# Altium project FOC module.PrjPcb
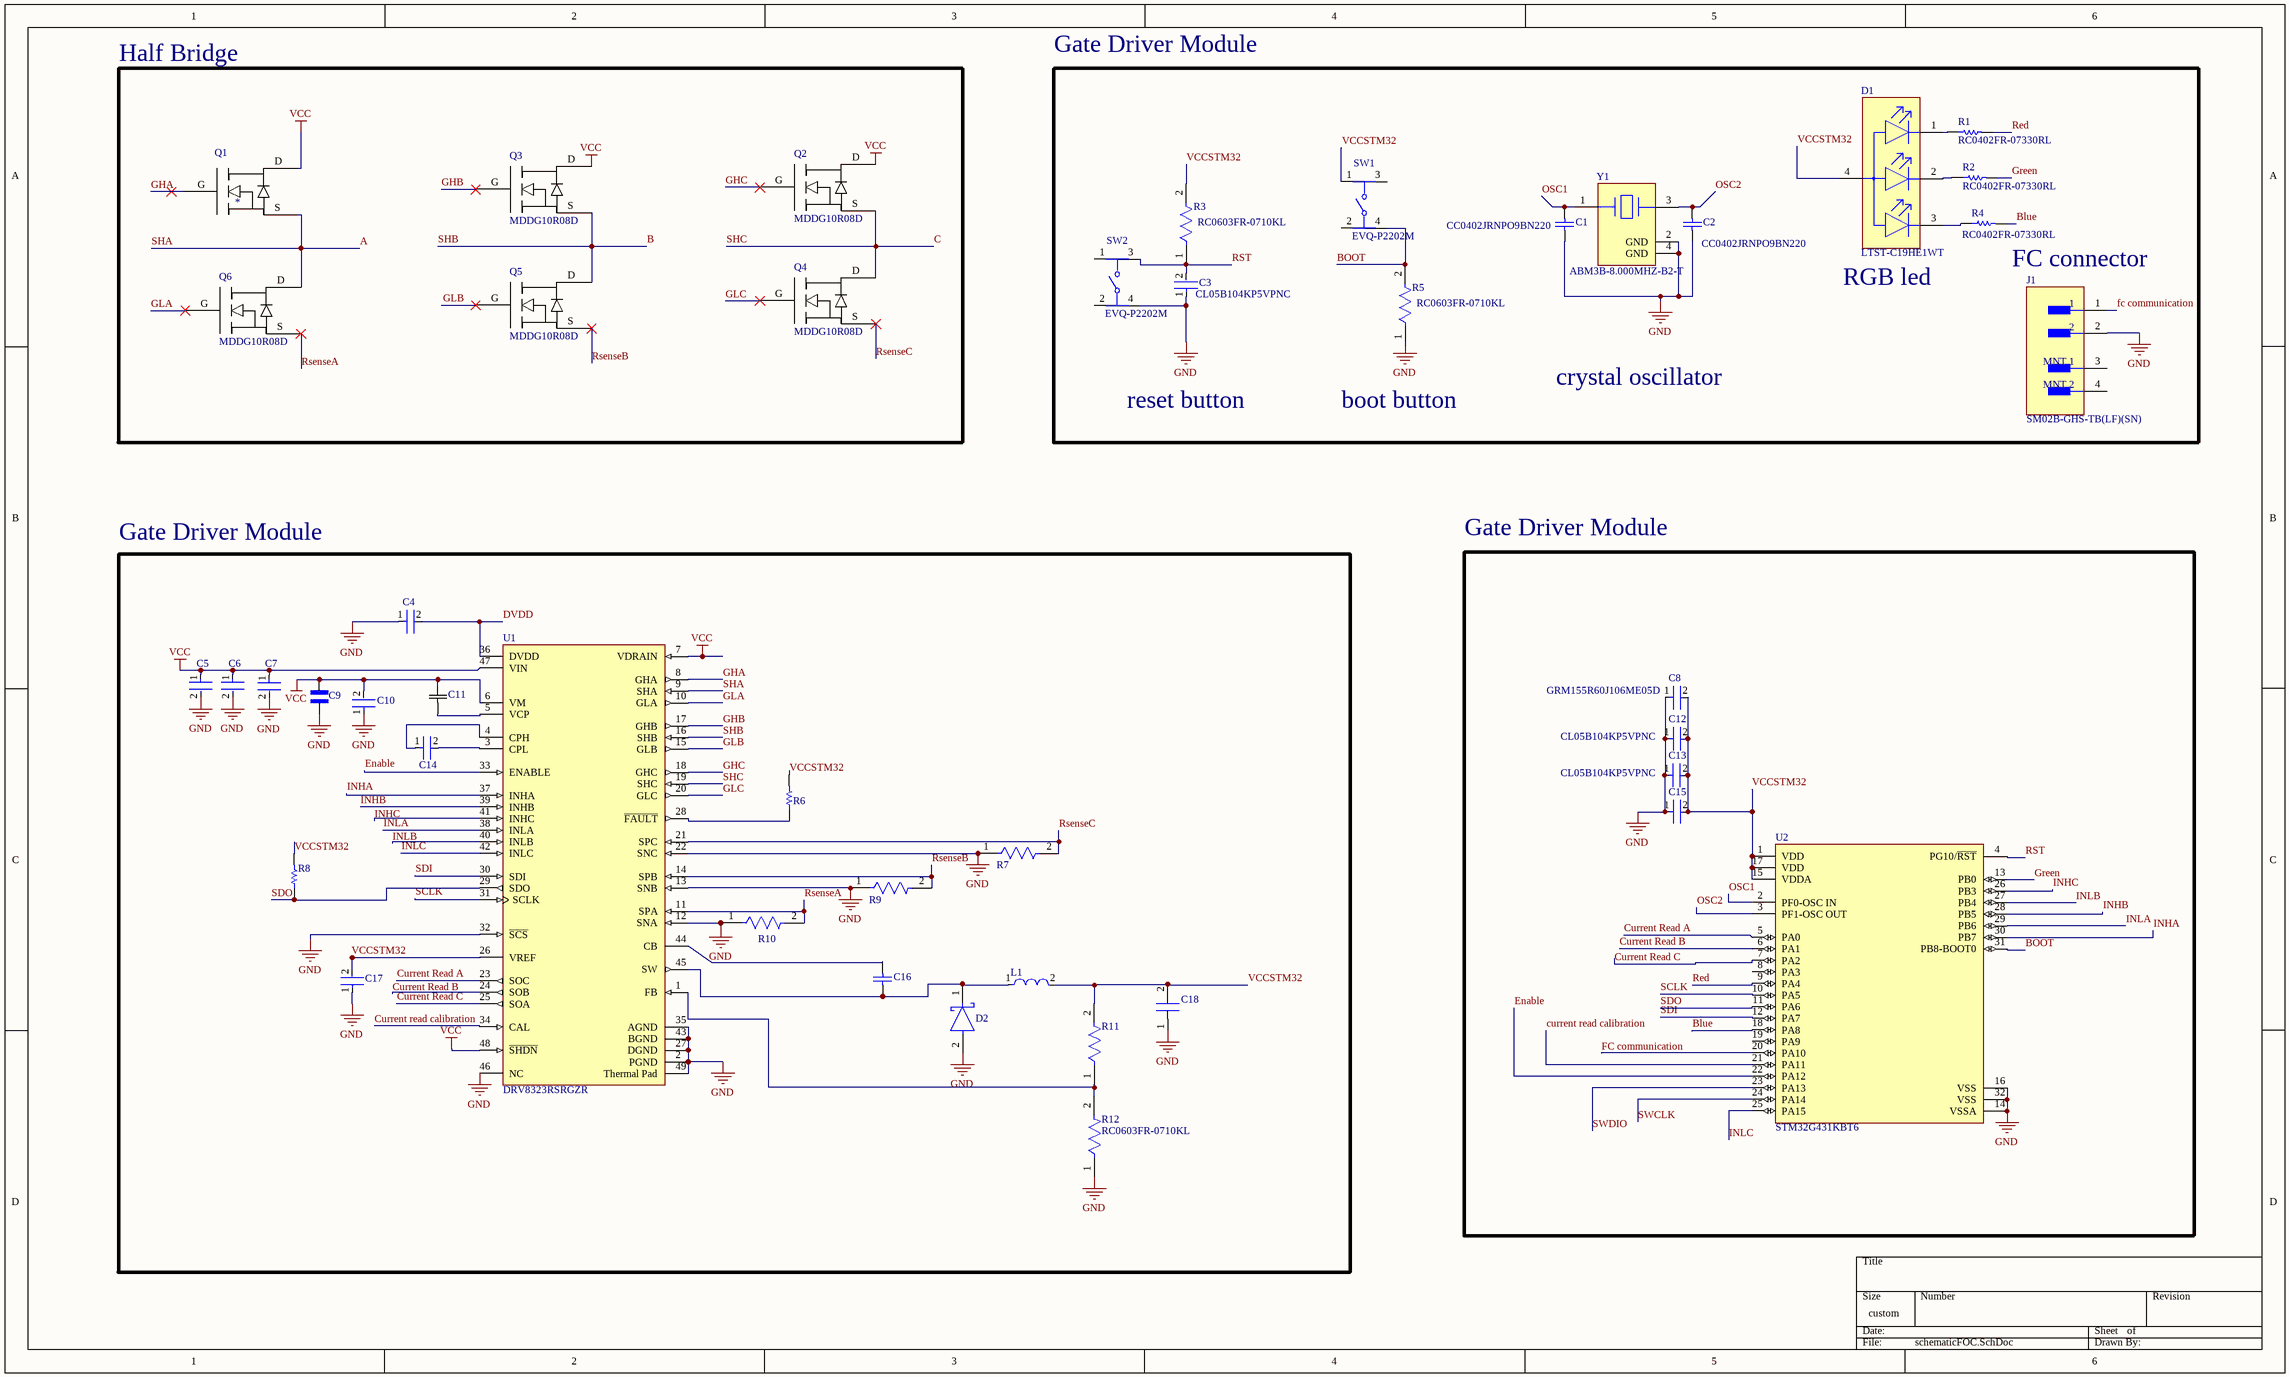
[diagram p0: schematicFOC.SchDoc]
1 sheet, 45 parts. Net scope: global (net labels, ports and power ports of the same name join across sheets).
Board file: PCBFOC.PcbDoc

## Sheet schematicFOC.SchDoc
size 500 x 299 mm; SheetNumber: 1; SheetTotal: 1

### Parts
C1  CC0402JRNPO9BN220  [CAPC1005X55X25ML05T05]
C2  CC0402JRNPO9BN220  [CAPC1005X55X25ML05T05]
C3  CL05B104KP5VPNC  [FP-CL93-IPC_C]
C4  GRM155R70J105KA12D  [FP-GRM155-0_05-MFG]  (value not drawn)
C5  C3225X7R1N106K250AC  [FP-C3225-250-0_4-MFG]  (value not drawn)
C6  C3225X7R1N106K250AC  [FP-C3225-250-0_4-MFG]  (value not drawn)
C7  C3225X7R1N106K250AC  [FP-C3225-250-0_4-MFG]  (value not drawn)
C8  GRM155R60J106ME05D  [FP-GRM155-0_2-IPC_C]
C9  CL21B104KCFNNNE  [CAPC2012X135N]  (value not drawn)
C10  C3225X7R1N106K250AC  [FP-C3225-250-0_4-MFG]  (value not drawn)
C11  CL21B105KBFNNNE  [CAP_CL21_SAM]  (value not drawn)
C12  CL05B104KP5VPNC  [FP-CL93-IPC_C]
C13  CL05B104KP5VPNC  [FP-CL93-IPC_C]
C14  GCM21BR72A473KA37L  [FP-GCM21B-0_15-MFG]  (value not drawn)
C15  CL05B104KP5VPNC  [FP-CL93-IPC_C]  (value not drawn)
C16  C0603C105K4RACTU  [CAPC1608X90X35LL15T15]  (value not drawn)
C17  CL05B104KP5NNNC  [FP-CL17-IPC_C]  (value not drawn)
C18  CL32B476MPJNNNE  [CAPC3225X27N]  (value not drawn)
D1  LTST-C19HE1WT  [FP-LTST-C19HE1WT-MFG]
D2  SS16HE3_B/I  [FP-95400-MFG]  (value not drawn)
J1  SM02B-GHS-TB(LF)(SN)  [FP-SM02B-GHS-TB_LF_SN-MFG]
L1  NRS6045T220MMGK  [FP-NR6045-MFG]  (value not drawn)
Q1  *  [DPAK228P970X238-3N]
Q2  MDDG10R08D  [DPAK228P970X238-3N]
Q3  MDDG10R08D  [DPAK228P970X238-3N]
Q4  MDDG10R08D  [DPAK228P970X238-3N]
Q5  MDDG10R08D  [DPAK228P970X238-3N]
Q6  MDDG10R08D  [DPAK228P970X238-3N]
R1  RC0402FR-07330RL  [RESC1005X40X25LL05T10]
R2  RC0402FR-07330RL  [RESC1005X40X25LL05T10]
R3  RC0603FR-0710KL  [FP-RC0603-0_55-IPC_C]
R4  RC0402FR-07330RL  [RESC1005X40X25LL05T10]
R5  RC0603FR-0710KL  [FP-RC0603-0_55-IPC_C]
R6  RC0402FR-0710KL  [RESC1005X40X25LL05T10]  (value not drawn)
R7  CSS2H-2512R-1L00F  [FP-CSS2H-2512R-1L00F-MFG]  (value not drawn)
R8  RC0402FR-0710KL  [RESC1005X40X25LL05T10]  (value not drawn)
R9  CSS2H-2512R-1L00F  [FP-CSS2H-2512R-1L00F-MFG]  (value not drawn)
R10  CSS2H-2512R-1L00F  [FP-CSS2H-2512R-1L00F-MFG]  (value not drawn)
R11  ERA-3AEB303V  [FP-ERA3A-IPC_C]  (value not drawn)
R12  RC0603FR-0710KL  [FP-RC0603-0_55-IPC_C]
SW1  EVQ-P2202M  [FP-EVQ-P2202M-MFG]
SW2  EVQ-P2202M  [FP-EVQ-P2202M-MFG]
U1  DRV8323RSRGZR  [FP-RGZ0048A-MFG]
U2  STM32G431KBT6  [FP-LQFP32-5V-IPC_B]
Y1  ABM3B-8.000MHZ-B2-T  [FP-ABM3B-MFG]

### Blocks framed on the sheet
Half Bridge: Q1-Q6
Gate Driver Module: C4-C7 C9-C11 C14 C16-C18 D2 L1 R6-R12 U1
Gate Driver Module: C8 C12 C13 C15 U2

### Nets
GND: C1.1 C2.1 C3.1 C4.1 C5.2 C6.2 C7.2 C8.1 C9.1 C10.1 C12.1 C13.1 C15.1 C17.1 C18.1 D2.2(A) J1.2 R5.1 R7.1 R9.1 R10.1 R12.1 SW2.4 U1.2(PGND) U1.12(SNA) U1.13(SNB) U1.22(SNC) U1.27(DGND) U1.32(~{SCS}) U1.35(AGND) U1.43(BGND) U1.46(NC) U1.49(Thermal_Pad) U2.14(VSSA) U2.16(VSS) U2.32(VSS) Y1.2(GND) Y1.4(GND)
VCC: C5.1 C6.1 C7.1 C9.2 C10.2 C11.2 Q1.D Q2.D Q3.D U1.6(VM) U1.7(VDRAIN) U1.47(VIN) U1.48(~{SHDN})
A: Q1.S Q6.D U1.9(SHA)  [also labelled SHA]
B: Q3.S Q5.D U1.16(SHB)  [also labelled SHB]
Blue: R4.2 U2.18(PA8)
BOOT: R5.2 SW1.4 U2.31(PB8-BOOT0)
C: Q2.S Q4.D U1.19(SHC)  [also labelled SHC]
Current Read A: U1.23(SOC) U2.5(PA0)
Current Read B: U1.24(SOB) U2.6(PA1)
Current Read C: U1.25(SOA) U2.7(PA2)
Current read calibration: U1.34(CAL) U2.21(PA11)
DVDD: C4.2 U1.36(DVDD)
Enable: U1.33(ENABLE) U2.22(PA12)
FC communication: J1.1 U2.20(PA10)
GHA: Q1.G U1.8(GHA)
GHB: Q3.G U1.17(GHB)
GHC: Q2.G U1.18(GHC)
GLA: Q6.G U1.10(GLA)
GLB: Q5.G U1.15(GLB)
GLC: Q4.G U1.20(GLC)
Green: R2.2 U2.13(PB0)
INHA: U1.37(INHA) U2.30(PB7)
INHB: U1.39(INHB) U2.28(PB5)
INHC: U1.41(INHC) U2.26(PB3)
INLA: U1.38(INLA) U2.29(PB6)
INLB: U1.40(INLB) U2.27(PB4)
INLC: U1.42(INLC) U2.25(PA15)
OSC1: C1.2 U2.2(PF0-OSC_IN) Y1.1
OSC2: C2.2 U2.3(PF1-OSC_OUT) Y1.3
Red: R1.2 U2.9(PA4)
RsenseA: Q6.S R10.2 U1.11(SPA)
RsenseB: Q5.S R9.2 U1.14(SPB)
RsenseC: Q4.S R7.2 U1.21(SPC)
RST: C3.2 R3.1 SW2.3 U2.4(PG10/~{RST})
SCLK: U1.31(SCLK) U2.10(PA5)
SDI: U1.30(SDI) U2.12(PA7)
SDO: R8.1 U1.29(SDO) U2.11(PA6)
SWCLK: U2.24(PA14)
SWDIO: U2.23(PA13)
VCCSTM32: C8.2 C12.2 C13.2 C15.2 C17.2 C18.2 D1.4(A) L1.2 R3.2 R6.2 R8.2 R11.2 SW1.1 U1.26(VREF) U2.1(VDD) U2.15(VDDA) U2.17(VDD)
NetC11_1: C11.1 U1.5(VCP)
NetC14_1: C14.1 U1.4(CPH)
NetC14_2: C14.2 U1.3(CPL)
NetC16_1: C16.1 D2.1(C) L1.1 U1.45(SW)
NetC16_2: C16.2 U1.44(CB)
NetD1_1: D1.1(RED_C) R1.1
NetD1_2: D1.2(GREEN_C) R2.1
NetD1_3: D1.3(BLUE_C) R4.1
NetR6_1: R6.1 U1.28(~{FAULT})
NetR11_1: R11.1 R12.2 U1.1(FB)

Not connected (* = marked no-connect by the designer): J1 3(MNT_1) 4(MNT_2); SW1 2 3; SW2 1 2; U2 8(PA3) 19(PA9)

### Notes on the sheet
- Gate Driver Module
- RGB led
- FC connector
- reset button
- boot button
- crystal oscillator

### Library data of the parts
C1 C2 = CMP-2100-03590-1: Chip Capacitor, 22 pF, +/- 5%, 50 V, -55 to 125 degC, 0402 (1005 Metric), RoHS, Tape and Reel; Manufacturer: Yageo; Voltage Rating: 50V; Dielectric Material: Ceramic; Capacitance: 22pF; Temperature Coefficient: 30ppm/degC; Dielectric: C0G; Insulation Resistance: 100GR; Datasheet URL: http://www.yageo.com/NewPortal/yageodocoutput?fileName=/pdf/MLCC/UPY-GP_NP0_16V-to-50V_14.pdf; Depth: 0.5mm; Number of Pins: 2; Height: 0.5mm; Min Operating Temperature: -55degC; REACH SVHC: NoSVHC; Max Operating Temperature: 125degC; Voltage Rating (DC): 50V; Composition: Ceramic; Packaging: TapeandReel; Package Quantity: 1; Package Reference: 0402; Length: 1mm; Radiation Hardening: No; Package Description: 2-Pin Surface Mount Device, Body 1 x 0.5 mm; RoHSCompliant: True; Thickness: 0.022inch; Manufacturer URL: http://www.yageo.com/; Mount: SurfaceMount; Case Code (Metric): 1005; Case/Package: 0402; Tolerance: 5%; Termination: SMD/SMT; Width: 0.02inch; Datasheet Version: Rev. 14, 07/2016; Lead Free: LeadFree; Case Code (Imperial): 0402
C3 C12 C13 C15 = CMP-13271-000610-1: Cap Ceramic 100nF 10V X7R ±10% SMD 0402 +125°C Paper T/R
C4 = CMP-2008-04587-2: Chip Multilayer Ceramic Capacitors for General Purpose, 0402, 1.0uF, X7R, 15%, 10%, 6.3V; Capacitance: 1uF; Case Code (Metric): 1005; Min Operating Temperature: -55°C; Tolerance: 10%; Depth: 0.5mm; Max Operating Temperature: 125°C; Width: 0.5mm; Case Code (Imperial): 0402; Termination: SMD/SMT; Weight: 0.000212oz; Thickness: 0.022inch; Package Quantity: 10000; Packaging: Tape and Reel; Voltage Rating: 6.3V; Lead Free: Lead Free; Height: 0.5mm; Length: 1mm; Dielectric: X7R; Case/Package: 0402; Voltage Rating (DC): 6.3V; Material: Ceramic; Mount: Surface Mount
C5-C7 C10 = CMP-08246-003742-1: Multilayer Ceramic Capacitors 10uF ±10% 75V X7R SMD 1210; RoHS Compliant: Yes
C8 = CMP-06035-044652-1: Chip Multilayer Ceramic Capacitors for General Purpose, 0402, 10uF, X5R, 15%, 20%, 6.3V
C9 = CL21B104KCFNNNE: 0.1 ÂµF Â±10% 100V Ceramic Capacitor X7R 0805 (2012 Metric); MF: Samsung; SnapEDA_Link: https://www.snapeda.com/parts/CL21B104KCFNNNE/Samsung/view-part/?ref=snap; Package: SMD-2 Samsung; Value: *; MP: CL21B104KCFNNNE; Check_prices: https://www.snapeda.com/parts/CL21B104KCFNNNE/Samsung/view-part/?ref=eda
C11 = CL21B105KBFNNNE: Description; Manufacturer_Name: Samsung; Copyright: Copyright (C) 2025 Ultra Librarian. All rights reserved.; Manufacturer_Part_Number: CL21B105KBFNNNE
C14 = CMP-2007-03365-2: Ceramic Capacitor for Automotive 47nF ±10% 100VDC X7R 0805 Embossed T/R; Voltage Rating (DC): 100V; Depth: 1.25mm; Radiation Hardening: No; Ratings: AEC-Q200; Case Code (Metric): 2012; Length: 2mm; Width: 0.049inch; Lead Free: Lead Free; Case/Package: 0805; Packaging: Tape and Reel; Height: 1.25mm; Capacitance: 47nF; Package Quantity: 3000; Max Operating Temperature: 125°C; Min Operating Temperature: -55°C; Dielectric: X7R; Case Code (Imperial): 0805; Voltage Rating: 100V; Thickness: 0.055inch; Termination: SMD/SMT; Mount: Surface Mount; Tolerance: 10%
C16 = CMP-2006-02298-2: Manufacturer: Kemet; Part Number: C0603C105K4RACTU
C17 = CMP-13271-001069-1: Cap Ceramic 100nF 10V X7R ±10% SMD 0402 +125°C Paper T/R; Height: 0.5mm; Case/Package: 0402; Contact Plating: Tin; Case Code (Imperial): 0402; Capacitance: 100nF; Thickness: 0.022inch; Min Operating Temperature: -55°C; Package Quantity: 1; Length: 1mm; Max Operating Temperature: 125°C; Depth: 0.5mm; Voltage Rating: 10V; Packaging: Tape and Reel; Mount: Surface Mount; Tolerance: 10%; Width: 0.02inch; Radiation Hardening: No; Case Code (Metric): 1005; Dielectric: X7R
D1 = CMP-2000-05201-2: LED RGB DIFFUSED CHIP SMD; Number of LEDs: 3; Test Current: 20mA; Luminous Intensity: 180mcd; Lens Color: White; Dominant Wavelength: 470nm; Color: Blue; Reverse Voltage: 5V; Viewing Angle: 130°; Forward Voltage: 3.35V; Max Operating Temperature: 80°C; Packaging: Tape and Reel; Lens Transparency: Diffused; Width: 1.6mm; Case Code (Metric): 1616; Height: 0.35mm; Lens Style: Diffused; Mount: Surface Mount; Package Quantity: 3000; Radiation Hardening: No; Length: 1.6mm; Case/Package: 0606; Forward Current: 20mA; Case Code (Imperial): 0606; Lead Free: Lead Free; Min Operating Temperature: -20°C; Number of Elements: 3; Number of Pins: 4; Depth: 1.6mm
D2 = CMP-02539-000060-1: DIODE SCHOTTKY 60V 1A DO214AC; RoHS Compliant: Yes
J1 = CMP-2000-07076-2: CONN HEADER SMD R/A 2POS 1.25MM; Voltage Rating: 50V; Number of Positions: 2; Pitch: 0.049inch; Current Rating: 1A; Connector Type: Outer Shroud Contact; Number of Rows: 1; Contact Material: Bronze; Termination: Solder; Color: Natural; Package Quantity: 2500; Mount: Surface Mount; Housing Color: Natural; Number of Contacts: 2; Packaging: Tape and Reel; Lead Free: Lead Free; Housing Material: Nylon; Orientation: Right Angle; Contact Type: Male Pin; Contact Plating: Tin; Series: GH; Fastening Type: Latch
L1 = CMP-14484-001341-1: Shielded Wirewound Inductor 22uH 20% 1.9A 0.1391Ω SMD; Test Frequency: 100kHz; RMS Current (Irms): 1.6A; Saturation Current: 2A; Core Material: Ferrite; Self Resonant Frequency: 7MHz; DC Resistance (DCR): 139.1mR; Radiation Hardening: No; Max Operating Temperature: 125°C; Series: NRS; Package Quantity: 1500; Min Operating Temperature: -25°C; Mount: Surface Mount; Inductance Tolerance: 20%; RoHS Compliant: Yes; Current Rating: 1.6A; Width: 0.236inch; Height - Seated (Max): 0.177inch; Height: 4.5mm; Packaging: Tape and Reel; Halogen Free: Halogen Free; Tolerance: 20%; Length: 6mm; Inductance: 22uH; Depth: 6.2mm; Number of Pins: 2; Lead Pitch: 4.7mm; Termination: SMD/SMT; Lead Free: Lead Free; Shielding: Shielded; Max DC Current: 2A; Case/Package: Nonstandard; Resistor Type: Wirewound
Q1 = MDDG10R08D
R1 R2 R4 = CMP-2002-07613-1: Manufacturer: Yageo / Phycomp; Part Number: RC0402FR-07330RL
R3 R5 R12 = CMP-2100-03664-2: RES 10K OHM 1% 1/10W 0603; Voltage Rating: 75V; Voltage Rating (DC): 50V; Resistance: 10kR; Power Rating: 100mW; Temperature Coefficient: 100ppm/°C; Depth: 0.8mm; Termination: SMD/SMT; Resistor Type: Thick Film; Series: RC; Construction: Rectangular; Features: Moisture Resistant; Packaging: Tape and Reel; Min Operating Temperature: -55°C; Number of Terminations: 2; Lead Pitch: 0.3mm; RoHS Compliant: Yes; Case/Package: 0603; Resistance Tolerance: 1%; Military Standard: Not; Weight: 7.1E-05oz; Number of Pins: 2; Tolerance: 1%; Length: 1.6mm; Case Code (Imperial): 0603; Lead Free: Lead Free; Width: 0.8mm; Max Power Dissipation: 100mW; Height: 0.45mm; Max Operating Temperature: 155°C; Case Code (Metric): 1608; Size Code: 0603
R6 R8 = CMP-2002-07353-1: Manufacturer: Yageo / Phycomp; Part Number: RC0402FR-0710KL
R7 R9 R10 = CMP-07231-006695-1: RES 0.001 OHM 1% 5W 2512; Temperature Coefficient: 50ppm/°C; Resistance: 1mR; Case Code (Imperial): 2512; Packaging: Cut Tape; Number of Terminations: 2; Width: 0.12inch; RoHS Compliant: Yes; Max Operating Temperature: 170°C; Features: Moisture Resistant; Height: 0.02inch; Resistor Type: Metal Element; Power Rating: 5W; Length: 0.25inch; Tolerance: 1%; Case/Package: 2512; Max Power Dissipation: 5W; REACH SVHC: No SVHC; Case Code (Metric): 6432; Min Operating Temperature: -55°C
R11 = CMP-2000-00027-2: RES SMD 30K OHM 0.1% 1/10W 0603; Voltage Rating: 75V; Temperature Coefficient: 25ppm/°C; Resistance: 30kR; Max Power Dissipation: 100mW; Number of Terminations: 2; Mount: Surface Mount; Depth: 0.8mm; Width: 0.8mm; Resistor Type: Thin Film; Tolerance: 0.1%; Construction: Rectangular; Max Operating Temperature: 155°C; Radiation Hardening: No; Height: 0.45mm; Size Code: 0603; Military Standard: Not; Packaging: Tape and Reel; Length: 1.6mm; Number of Pins: 2; Case Code (Metric): 1608; Resistance Tolerance: 0.1%; RoHS Compliant: Yes; Features: Automotive AEC-Q200; Contact Plating: Tin; Case/Package: 0603; Series: ERA-3A; Termination: SMD/SMT; Case Code (Imperial): 0603; Package Quantity: 1; REACH SVHC: No SVHC; Technology: THIN FILM; Power Rating: 100mW; Min Operating Temperature: -55°C
SW1 SW2 = CMP-05618-000029-1: SWITCH TACTILE SPST-NO 0.02A 15V; Contact Resistance: 100mR; Actuator Color: Natural; Illumination Type: Non-Illuminated; Switch Travel: 0.25mm; Switch Function: Off-Mom; Throw Configuration: SPST; Max Current Rating: 20mA; Operating Force: 1.6N; Mechanical Life: 1000000Cycles; Actuator Length: 0.45mm; Series: EVQP2; Height: 2.1mm; Max Operating Temperature: 85°C; Min Operating Temperature: -40°C; Voltage Rating (DC): 15V; Size: 3.5mm; Contact Plating: Gold; Contact Current Rating: 20mA; Radiation Hardening: No; REACH SVHC: No SVHC; Mount: Surface Mount; Length: 3.5mm; Packaging: Tape and Reel; Color: Natural; Orientation: Straight; Termination: J-Bend; Max Voltage Rating (DC): 15V; Lead Free: Lead Free; Depth: 5.5mm; Current Rating: 20mA; Package Quantity: 1; Electrical Life: 1000000Cycles
U1 = CMP-04915-000002-1: IC MTR DRV MULTIPHAS 6-60V 48QFN; Manufacturer: Texas Instruments; Min Supply Voltage: 4V; Switching Frequency: 700kHz; Nominal Supply Current: 10.5mA; Max Supply Voltage: 60V; Standoff Height: 0mm; Motor Type: Brushless DC; Output Current: 5mA; Max Junction Temp: +150°C; Category: IC; Digikey Description: IC MTR DRV MULTIPHAS 6-60V 48QFN; Height: 1mm; Lead Free: Yes; Device Class L1: Integrated Circuits (ICs); ComponentLink2Description: Datasheet; Manufacturer Part Number: DRV8323RSRGZR; RoHS: TRUE; ComponentLink2URL: http://www.ti.com/lit/ds/symlink/drv8323r.pdf; Ambient Temperature Range Low: -40°C; Octopart: https://octopart.com/drv8323rsrgzr-texas+instruments-80665177; Ambient Temperature Range High: +125°C; Temperature Range Low: -40°C; Temperature Range High: +125°C; Device Class L3: Motor Drivers; Package: RGZ0048A; Automotive: No; Device Class L2: Power Management ICs; Temperature: -40°C to +125°C; Mouser Description: Triple Half Bridge Motor Driver 48-Pin VQFN EP T/R
U2 = CMP-12105-000140-1: IC MCU 32BIT 128KB FLASH 32LQFP
Y1 = CMP-1688-00002-2: Crystal 8MHz ±20ppm 18pF SMD-4 5mm x 3.2mm; ESR (Equivalent Series Resistance): 200R; Frequency Stability: 50ppm; Operating Frequency: 8 MHz; Mount: Surface Mount; Number of Pins: 4; Packaging: Tape and Reel; Width: 0.126inch; Case/Package: CSMD; Lead Free: Lead Free; Depth: 3.2mm; Load Capacitance: 18pF; Min Operating Temperature: -20°C; Series: ABM3B; Package Quantity: 1000; Resistor Type: Ceramic; Height: 0.043inch; Max Operating Temperature: 70°C; Frequency Tolerance: 20ppm; Series Resistance: 200R; Tolerance: 20ppm; Termination: SMD/SMT; Length: 5mm; Frequency: 8MHz
C18 = CL32B476MPJNNNE: Supplier 1: Future Electronics; Supplier Part Number 1: CL32B476MPJNNNE